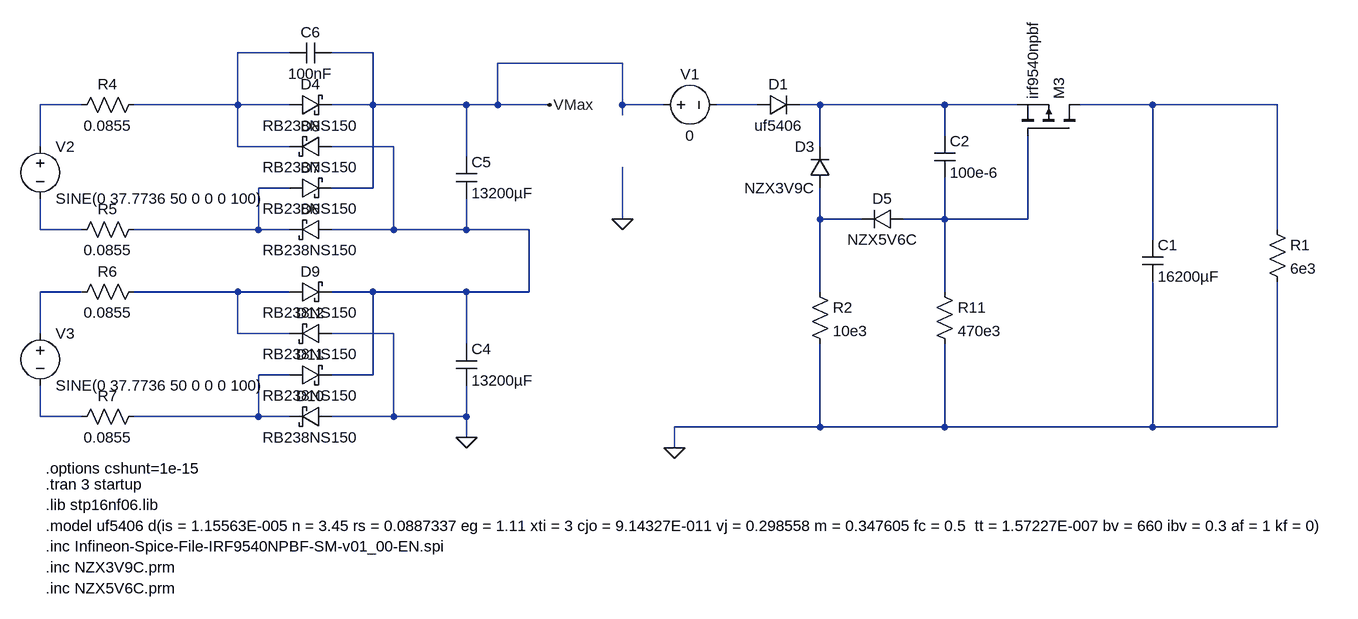
[diagram p0: schematic CapInrush.asc]
CapInrush.asc, the LTspice schematic file:
Version 4
SHEET 1 2944 968
WIRE -1792 -176 -1872 -176
WIRE -1664 -176 -1728 -176
WIRE -1280 -160 -1472 -160
WIRE -2112 -96 -2176 -96
WIRE -1872 -96 -1872 -176
WIRE -1872 -96 -2032 -96
WIRE -1792 -96 -1872 -96
WIRE -1664 -96 -1664 -176
WIRE -1664 -96 -1728 -96
WIRE -1520 -96 -1664 -96
WIRE -1472 -96 -1472 -160
WIRE -1472 -96 -1520 -96
WIRE -1392 -96 -1472 -96
WIRE -1280 -96 -1280 -160
WIRE -1216 -96 -1280 -96
WIRE -1072 -96 -1136 -96
WIRE -976 -96 -1008 -96
WIRE -784 -96 -976 -96
WIRE -672 -96 -784 -96
WIRE -464 -96 -576 -96
WIRE -272 -96 -464 -96
WIRE -1280 -80 -1280 -96
WIRE -784 -48 -784 -96
WIRE -2176 -32 -2176 -96
WIRE -1872 -32 -1872 -96
WIRE -1792 -32 -1872 -32
WIRE -1632 -32 -1728 -32
WIRE -976 -32 -976 -96
WIRE -1520 -16 -1520 -96
WIRE -1792 32 -1840 32
WIRE -1664 32 -1664 -96
WIRE -1664 32 -1728 32
WIRE -1280 80 -1280 0
WIRE -976 80 -976 32
WIRE -912 80 -976 80
WIRE -784 80 -784 16
WIRE -784 80 -848 80
WIRE -656 80 -656 -48
WIRE -656 80 -784 80
WIRE -2176 96 -2176 48
WIRE -2112 96 -2176 96
WIRE -1840 96 -1840 32
WIRE -1840 96 -2032 96
WIRE -1792 96 -1840 96
WIRE -1632 96 -1632 -32
WIRE -1632 96 -1728 96
WIRE -1520 96 -1520 48
WIRE -1520 96 -1632 96
WIRE -1424 96 -1520 96
WIRE -272 96 -272 -96
WIRE -464 112 -464 -96
WIRE -2112 192 -2176 192
WIRE -1872 192 -2032 192
WIRE -1792 192 -1872 192
WIRE -1664 192 -1728 192
WIRE -1520 192 -1664 192
WIRE -1424 192 -1424 96
WIRE -1424 192 -1520 192
WIRE -976 192 -976 80
WIRE -784 192 -784 80
WIRE -2176 256 -2176 192
WIRE -1872 256 -1872 192
WIRE -1792 256 -1872 256
WIRE -1632 256 -1728 256
WIRE -1520 272 -1520 192
WIRE -1792 320 -1840 320
WIRE -1664 320 -1664 192
WIRE -1664 320 -1728 320
WIRE -2176 384 -2176 336
WIRE -2112 384 -2176 384
WIRE -1840 384 -1840 320
WIRE -1840 384 -2032 384
WIRE -1792 384 -1840 384
WIRE -1632 384 -1632 256
WIRE -1632 384 -1728 384
WIRE -1520 384 -1520 336
WIRE -1520 384 -1632 384
WIRE -976 400 -976 272
WIRE -976 400 -1200 400
WIRE -784 400 -784 272
WIRE -784 400 -976 400
WIRE -464 400 -464 176
WIRE -464 400 -784 400
WIRE -272 400 -272 176
WIRE -272 400 -464 400
WIRE -1520 416 -1520 384
WIRE -1200 432 -1200 400
FLAG -1200 432 0
FLAG -1520 416 0
FLAG -1392 -96 VMax
FLAG -1280 80 0
SYMBOL voltage -2176 -48 R0
WINDOW 123 0 0 Left 0
WINDOW 39 0 0 Left 0
SYMATTR InstName V2
SYMATTR Value SINE(0 37.7736 50 0 0 0 100)
SYMBOL schottky -1792 -80 R270
WINDOW 0 32 32 VTop 2
WINDOW 3 0 32 VBottom 2
SYMATTR InstName D4
SYMATTR Value RB238NS150
SYMATTR Description Diode
SYMATTR Type diode
SYMBOL schottky -1728 80 R90
WINDOW 0 0 32 VBottom 2
WINDOW 3 32 32 VTop 2
SYMATTR InstName D6
SYMATTR Value RB238NS150
SYMATTR Description Diode
SYMATTR Type diode
SYMBOL schottky -1792 48 R270
WINDOW 0 32 32 VTop 2
WINDOW 3 0 32 VBottom 2
SYMATTR InstName D7
SYMATTR Value RB238NS150
SYMATTR Description Diode
SYMATTR Type diode
SYMBOL schottky -1728 -48 R90
WINDOW 0 0 32 VBottom 2
WINDOW 3 32 32 VTop 2
SYMATTR InstName D8
SYMATTR Value RB238NS150
SYMATTR Description Diode
SYMATTR Type diode
SYMBOL res -2016 -112 R90
WINDOW 0 0 56 VBottom 2
WINDOW 3 32 56 VTop 2
SYMATTR InstName R4
SYMATTR Value 0.0855
SYMBOL schottky -1792 208 R270
WINDOW 0 32 32 VTop 2
WINDOW 3 0 32 VBottom 2
SYMATTR InstName D9
SYMATTR Value RB238NS150
SYMATTR Description Diode
SYMATTR Type diode
SYMBOL schottky -1728 368 R90
WINDOW 0 0 32 VBottom 2
WINDOW 3 32 32 VTop 2
SYMATTR InstName D10
SYMATTR Value RB238NS150
SYMATTR Description Diode
SYMATTR Type diode
SYMBOL schottky -1792 336 R270
WINDOW 0 32 32 VTop 2
WINDOW 3 0 32 VBottom 2
SYMATTR InstName D11
SYMATTR Value RB238NS150
SYMATTR Description Diode
SYMATTR Type diode
SYMBOL schottky -1728 240 R90
WINDOW 0 0 32 VBottom 2
WINDOW 3 32 32 VTop 2
SYMATTR InstName D12
SYMATTR Value RB238NS150
SYMATTR Description Diode
SYMATTR Type diode
SYMBOL res -2016 80 R90
WINDOW 0 0 56 VBottom 2
WINDOW 3 32 56 VTop 2
SYMATTR InstName R5
SYMATTR Value 0.0855
SYMBOL voltage -2176 240 R0
WINDOW 123 0 0 Left 0
WINDOW 39 0 0 Left 0
SYMATTR InstName V3
SYMATTR Value SINE(0 37.7736 50 0 0 0 100)
SYMBOL res -2016 176 R90
WINDOW 0 0 56 VBottom 2
WINDOW 3 32 56 VTop 2
SYMATTR InstName R6
SYMATTR Value 0.0855
SYMBOL res -2016 368 R90
WINDOW 0 0 56 VBottom 2
WINDOW 3 32 56 VTop 2
SYMATTR InstName R7
SYMATTR Value 0.0855
SYMBOL cap -1536 272 R0
SYMATTR InstName C4
SYMATTR Value 13200µF
SYMATTR SpiceLine V=50
SYMBOL cap -1536 -16 R0
SYMATTR InstName C5
SYMATTR Value 13200µF
SYMATTR SpiceLine V=50
SYMBOL cap -1728 -192 R90
WINDOW 0 0 32 VBottom 2
WINDOW 3 32 32 VTop 2
SYMATTR InstName C6
SYMATTR Value 100nF
SYMATTR SpiceLine V=60
SYMBOL voltage -1232 -96 R270
WINDOW 0 32 56 VTop 2
WINDOW 3 -32 56 VBottom 2
WINDOW 123 0 0 Left 0
WINDOW 39 0 0 Left 0
SYMATTR InstName V1
SYMATTR Value 0
SYMBOL pmos -576 -48 M270
SYMATTR InstName M3
SYMATTR Value irf9540npbf
SYMATTR Prefix X
SYMBOL cap -480 112 R0
SYMATTR InstName C1
SYMATTR Value 16200µF
SYMATTR SpiceLine V=80
SYMBOL res -800 176 R0
SYMATTR InstName R11
SYMATTR Value 470e3
SYMBOL cap -800 -48 R0
SYMATTR InstName C2
SYMATTR Value 100e-6
SYMBOL res -288 80 R0
SYMATTR InstName R1
SYMATTR Value 6e3
SYMBOL diode -1072 -80 R270
WINDOW 0 32 32 VTop 2
WINDOW 3 0 32 VBottom 2
SYMATTR InstName D1
SYMATTR Value uf5406
SYMBOL diode -960 32 R180
WINDOW 0 24 64 Left 2
WINDOW 3 24 0 Left 2
SYMATTR InstName D3
SYMATTR Value NZX3V9C
SYMATTR Prefix X
SYMBOL diode -848 64 R90
WINDOW 0 0 32 VBottom 2
WINDOW 3 32 32 VTop 2
SYMATTR InstName D5
SYMATTR Value NZX5V6C
SYMATTR Prefix X
SYMBOL res -992 176 R0
SYMATTR InstName R2
SYMATTR Value 10e3
TEXT -2168 520 Left 2 !.lib stp16nf06.lib
TEXT -2168 488 Left 2 !.tran 3 startup
TEXT -2168 552 Left 2 !.model uf5406 d(is = 1.15563E-005 n = 3.45 rs = 0.0887337 eg = 1.11 xti = 3 cjo = 9.14327E-011 vj = 0.298558 m = 0.347605 fc = 0.5  tt = 1.57227E-007 bv = 660 ibv = 0.3 af = 1 kf = 0)
TEXT -2168 648 Left 2 !.inc NZX5V6C.prm
TEXT -2168 616 Left 2 !.inc NZX3V9C.prm
TEXT -2168 584 Left 2 !.inc Infineon-Spice-File-IRF9540NPBF-SM-v01_00-EN.spi
TEXT -2168 464 Left 2 !.options cshunt=1e-15

The netlist it stands for:
* CapInrush.asc
V2 N002 N010 SINE(0 37.7736 50 0 0 0 100)
D4 N001 VMax RB238NS150
D6 N006 N007 RB238NS150
D7 N007 VMax RB238NS150
D8 N006 N001 RB238NS150
R4 N001 N002 0.0855
D9 N012 N006 RB238NS150
D10 0 N013 RB238NS150
D11 N013 N006 RB238NS150
D12 0 N012 RB238NS150
R5 N007 N010 0.0855
V3 N011 N014 SINE(0 37.7736 50 0 0 0 100)
R6 N012 N011 0.0855
R7 N013 N014 0.0855
C4 N006 0 13200µF V=50
C5 VMax N006 13200µF V=50
C6 VMax N001 100nF V=60
V1 VMax N003 0
XM3 N005 N009 N004 irf9540npbf  ; pins D G S
C1 N005 0 16200µF V=80
R11 N009 0 470e3
C2 N004 N009 100e-6
R1 N005 0 6e3
D1 N003 N004 uf5406
XD3 N008 N004 NZX3V9C  ; pins + -
XD5 N009 N008 NZX5V6C  ; pins + -
R2 N008 0 10e3
.model D D
.lib standard.dio
.lib stp16nf06.lib
.tran 3 startup
.model uf5406 d(is = 1.15563E-005 n = 3.45 rs = 0.0887337 eg = 1.11 xti = 3 cjo = 9.14327E-011 vj = 0.298558 m = 0.347605 fc = 0.5  tt = 1.57227E-007 bv = 660 ibv = 0.3 af = 1 kf = 0)
.inc NZX5V6C.prm
.inc NZX3V9C.prm
.inc Infineon-Spice-File-IRF9540NPBF-SM-v01_00-EN.spi
.options cshunt=1e-15
.backanno
.end